# Altium schematic sheet SHC_machnguon_v2.SchDoc
size A
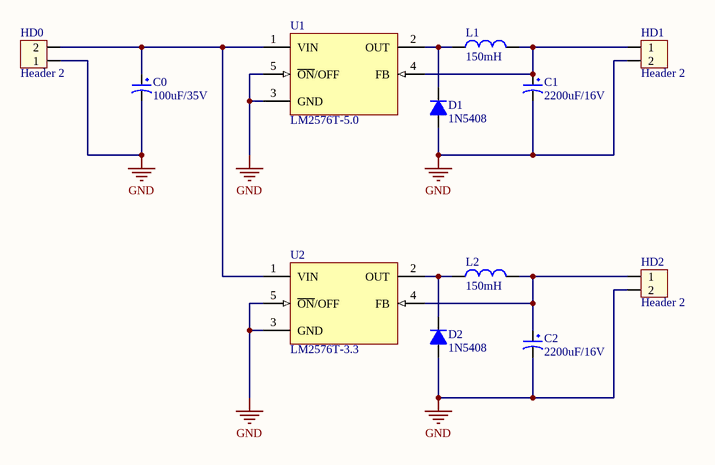
[diagram p0: SHC_machnguon_v2.SchDoc]

## Parts
C0  100uF/35V  [CP1.5/3.4]
C1  2200uF/16V  [CP2/4]
C2  2200uF/16V  [CP2/4]
D1  1N5408  [D5A]
D2  1N5408  [D5A]
HD0  Header 2  [HED2]
HD1  Header 2  [HED2]
HD2  Header 2  [HED2]
L1  150mH  [L/0.4]
L2  150mH  [L/0.4]
U1  LM2576T-5.0  [LM2576t]
U2  LM2576T-3.3  [LM2576t]

## Nets
GND: C0.2 C1.2 C2.2 D1.1(A) D2.1(A) HD0.1 HD1.2 HD2.2 U1.3(GND) U1.5(~{ON}/OFF) U2.3(GND) U2.5(~{ON}/OFF)
NetC0_1: C0.1 HD0.2 U1.1(VIN) U2.1(VIN)
NetC1_1: C1.1 HD1.1 L1.2 U1.4(FB)
NetC2_1: C2.1 HD2.1 L2.2 U2.4(FB)
NetD1_2: D1.2(K) L1.1 U1.2(OUT)
NetD2_2: D2.2(K) L2.1 U2.2(OUT)

## Library data of the parts
C0 = CP3: Cap 100uF/35V - 470uF/16V; Value: 100uF/35V/50V; Description 1: 1000uF/6,3V - 470uF/16V - 330uF - 25V; Description 2: 220uF/35V - 100uF/50V - 63V - 4,7uF/200V; Description 3: 22uF => 33uF100V - 3,3uF => 4,7uF/250V; Description 4: 2,2uF =>3,3uF/350 - 2,2uF/400V - 1uF/450V
C1 C2 = CP5: Cap 2200uF/16V - 1000uF/50V; Description 5: 47uF/200V - 22uF/350V - 400V - 10uF/450V; Description 1: 4700uF-6800uF/6,3V - 3300uF-4700uF/10V; Description 2: 2200uF-3300uF/16V - 470uF => 2200uF/25V; Description 3: 1000uF/35V-50V_470uF/63V_220uF>330uF/100V; Description 4: 47uF => 100uF/160V - 33uF-47uF/250V; Value: 2200uF/16V
D1 D2 = D5A: Diode 5A; Value: 1N5408
HD0-HD2 = Hed2: Header 2 (Green); Value: Header 2
L1 L2 = L1: Inductor; Value: 150 mH
U1 U2 = LM2576T-5.0: SIMPLE SWITCHER; 3A Step-Down Voltage Regulator; Manufacturer: National Semiconductor; PackageTopMarking: NSUZXYTT*LM2576T*-5.0 P+; PowerWise: N; FirstPublished: 4-Dec-2008; DatasheetVersion: Aug-2004; PackageVersion: revJ, Jan-1992; PackageReference: T05A; Publisher: Altium Limited; PackageDescription: TO-220, Molded, 5 Lead, Straight; CompType: Switcher; PartNumber: LM2576T-5.0; RoHS: O; PinCount: 5; DigiKeyPartNumber: LM2576T-5.0-ND; Code_JEDEC: TO-220-AB; ComponentLink1Description: LM2576 Datasheet; ComponentLink1URL: http://www.national.com/ds/LM/LM2576.pdf; ComponentLink2Description: LM2576 Web Page; ComponentLink2URL: http://www.national.com/pf/LM/LM2576.html; ComponentLink3Description: T05A Package Page; ComponentLink3URL: http://www.national.com/packaging/folders/t05a.html